# Altium schematic sheet remap.SchDoc
size A4
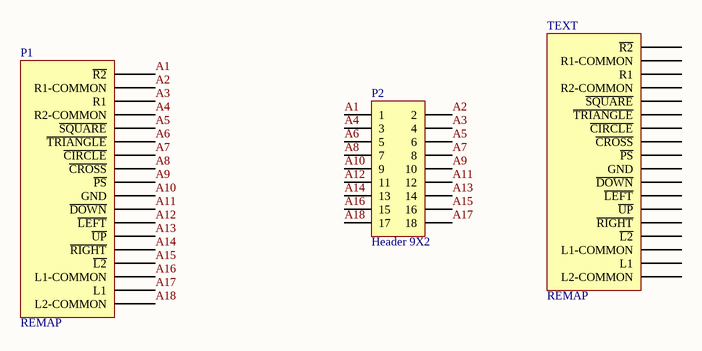
[diagram p0: remap.SchDoc]

## Parts
P1  REMAP  [remap]
P2  Header 9X2  [HDR2X9]
TEXT  REMAP  [text]

## Nets
A1: P1.A1(~{R2}) P2.1
A2: P1.A2(R1-COMMON) P2.2
A3: P1.A3(R1) P2.4
A4: P1.A4(R2-COMMON) P2.3
A5: P1.A5(~{SQUARE}) P2.6
A6: P1.A6(~{TRIANGLE}) P2.5
A7: P1.A7(~{CIRCLE}) P2.8
A8: P1.A8(~{CROSS}) P2.7
A9: P1.A9(~{PS}) P2.10
A10: P1.A10(GND) P2.9
A11: P1.A11(~{DOWN}) P2.12
A12: P1.A12(~{LEFT}) P2.11
A13: P1.A13(~{UP}) P2.14
A14: P1.A14(~{RIGHT}) P2.13
A15: P1.A15(~{L2}) P2.16
A16: P1.A16(L1-COMMON) P2.15
A17: P1.A17(L1) P2.18
A18: P1.A18(L2-COMMON) P2.17

Not connected (* = marked no-connect by the designer): TEXT A1(~{R2}) A2(R1-COMMON) A3(R1) A4(R2-COMMON) A5(~{SQUARE}) A6(~{TRIANGLE}) A7(~{CIRCLE}) A8(~{CROSS}) A9(~{PS}) A10(GND) A11(~{DOWN}) A12(~{LEFT}) A13(~{UP}) A14(~{RIGHT}) A15(~{L2}) A16(L1-COMMON) A17(L1) A18(L2-COMMON)

## Library data of the parts
P2 = Header 9X2: Header, 9-Pin, Dual row; LatestRevisionDate: 17-Jul-2002; LatestRevisionNote: Re-released for DXP Platform.; Publisher: Altium Limited